# Altium project LPCB225__RLOOP__BMS.PrjPCB
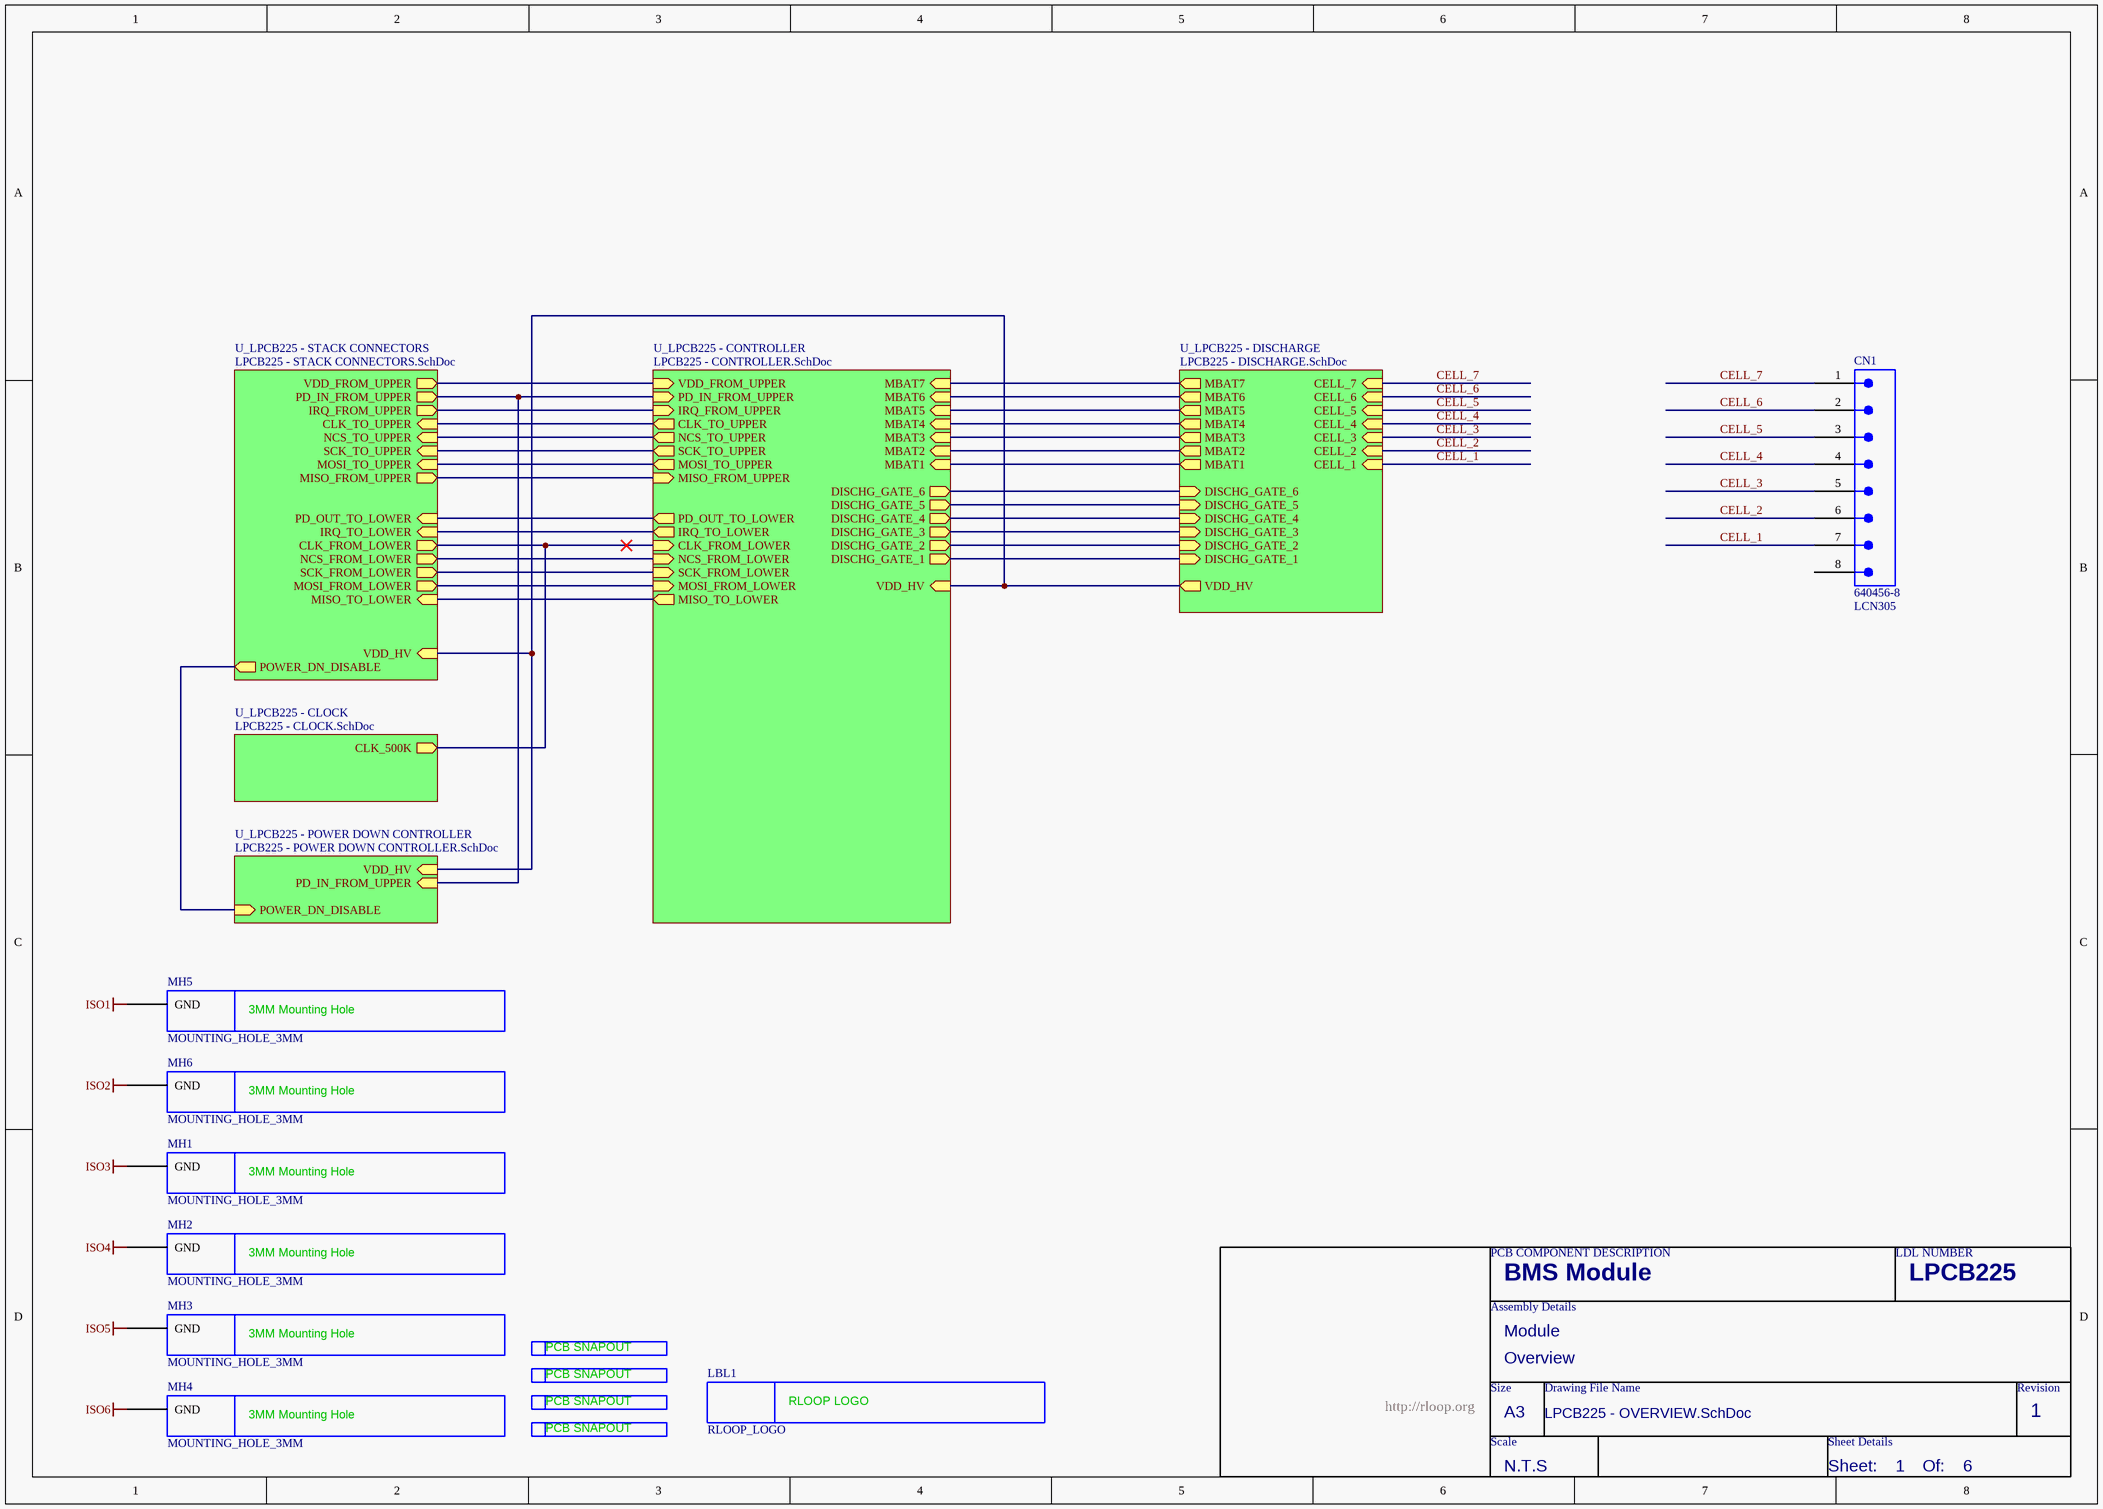
[diagram p0: LPCB225 - OVERVIEW.SchDoc]
6 sheets, 102 parts. Net scope: hierarchical (ports join the sheet entries above them; power ports are global).
Board files: LPCB225R0.PcbDoc, LPCB225R0__ASCII.PcbDoc
Sheets:
  LPCB225 - OVERVIEW.SchDoc
    U_LPCB225 - CONTROLLER = LPCB225 - CONTROLLER.SchDoc
    U_LPCB225 - DISCHARGE = LPCB225 - DISCHARGE.SchDoc
    U_LPCB225 - STACK CONNECTORS = LPCB225 - STACK CONNECTORS.SchDoc
    U_LPCB225 - CLOCK = LPCB225 - CLOCK.SchDoc
    U_LPCB225 - POWER DOWN CONTROLLER = LPCB225 - POWER DOWN CONTROLLER.SchDoc

## Sheet LPCB225 - OVERVIEW.SchDoc
size A3; Address1: Factory 10; Address2: 9-13 Dingley Avenue, Dandeong, VICTORIA 3175, AUSTRALIA; DocumentNumber: 1; Revision: 1; SheetNumber: 1; SheetTotal: 6; Lockie__PCB_SUB_ASSEMBLY: Overview; Lockie__PCB_ASSEMBLY: Module; Lockie__LDL: LPCB225; Lockie__PCB_DESCRIPTION: BMS Module

### Parts
CN1  640456-8  LDL_NUMBER: LCN305  [640456-8]
LBL1  RLOOP_LOGO  [RLOOP_LOGO]  (no BOM)
MH1  MOUNTING_HOLE_3MM  [MOUNTING_HOLE_3MM]  (no BOM)
MH2  MOUNTING_HOLE_3MM  [MOUNTING_HOLE_3MM]  (no BOM)
MH3  MOUNTING_HOLE_3MM  [MOUNTING_HOLE_3MM]  (no BOM)
MH4  MOUNTING_HOLE_3MM  [MOUNTING_HOLE_3MM]  (no BOM)
MH5  MOUNTING_HOLE_3MM  [MOUNTING_HOLE_3MM]  (no BOM)
MH6  MOUNTING_HOLE_3MM  [MOUNTING_HOLE_3MM]  (no BOM)
SN1  PCB_SNAPOUT  [SNAPOUT_NEW]  (value not drawn)  (no BOM)
SN2  PCB_SNAPOUT  [SNAPOUT_NEW]  (value not drawn)  (no BOM)
SN3  PCB_SNAPOUT  [SNAPOUT_NEW]  (value not drawn)  (no BOM)
SN4  PCB_SNAPOUT  [SNAPOUT_NEW]  (value not drawn)  (no BOM)

### Sub-sheets
U_LPCB225 - CLOCK = LPCB225 - CLOCK.SchDoc: CLK_500K (out)
U_LPCB225 - CONTROLLER = LPCB225 - CONTROLLER.SchDoc: PD_IN_FROM_UPPER (in), PD_OUT_TO_LOWER (out), IRQ_FROM_UPPER (in), CLK_TO_UPPER (out), NCS_TO_UPPER (out), SCK_TO_UPPER (out), MOSI_TO_UPPER (out), MISO_FROM_UPPER (in), IRQ_TO_LOWER (out), CLK_FROM_LOWER (in), NCS_FROM_LOWER (in), SCK_FROM_LOWER (in), MOSI_FROM_LOWER (in), MISO_TO_LOWER (out), VDD_FROM_UPPER (in), VDD_HV (in), MBAT7 (in), MBAT1 (in), MBAT2 (in), MBAT3 (in), MBAT4 (in), MBAT5 (in), MBAT6 (in), DISCHG_GATE_1 (out), DISCHG_GATE_2 (out), DISCHG_GATE_3 (out), DISCHG_GATE_4 (out), DISCHG_GATE_5 (out), DISCHG_GATE_6 (out)
U_LPCB225 - DISCHARGE = LPCB225 - DISCHARGE.SchDoc: CELL_7 (in), MBAT7 (out), DISCHG_GATE_6 (in), MBAT6 (out), DISCHG_GATE_5 (in), CELL_6 (in), MBAT5 (out), DISCHG_GATE_4 (in), CELL_5 (in), MBAT4 (out), DISCHG_GATE_3 (in), CELL_4 (in), MBAT3 (out), DISCHG_GATE_2 (in), CELL_3 (in), MBAT2 (out), DISCHG_GATE_1 (in), CELL_2 (in), CELL_1 (in), MBAT1 (out), VDD_HV (out)
U_LPCB225 - POWER DOWN CONTROLLER = LPCB225 - POWER DOWN CONTROLLER.SchDoc: PD_IN_FROM_UPPER (in), VDD_HV (in), POWER_DN_DISABLE (in)
U_LPCB225 - STACK CONNECTORS = LPCB225 - STACK CONNECTORS.SchDoc: PD_IN_FROM_UPPER (out), IRQ_FROM_UPPER (out), CLK_TO_UPPER (in), NCS_TO_UPPER (in), SCK_TO_UPPER (in), MOSI_TO_UPPER (in), MISO_FROM_UPPER (out), VDD_FROM_UPPER (out), PD_OUT_TO_LOWER (in), IRQ_TO_LOWER (in), CLK_FROM_LOWER (out), NCS_FROM_LOWER (out), SCK_FROM_LOWER (out), MOSI_FROM_LOWER (out), MISO_TO_LOWER (in), VDD_HV (in), POWER_DN_DISABLE (out)

### Nets
ISO1: MH5.MOUNT(GND)
ISO2: MH6.MOUNT(GND)
ISO3: MH1.MOUNT(GND)
ISO4: MH2.MOUNT(GND)
ISO5: MH3.MOUNT(GND)
ISO6: MH4.MOUNT(GND)
CELL_1: CN1.7 ; sheet U_LPCB225 - DISCHARGE/CELL_1
CELL_2: CN1.6 ; sheet U_LPCB225 - DISCHARGE/CELL_2
CELL_3: CN1.5 ; sheet U_LPCB225 - DISCHARGE/CELL_3
CELL_4: CN1.4 ; sheet U_LPCB225 - DISCHARGE/CELL_4
CELL_5: CN1.3 ; sheet U_LPCB225 - DISCHARGE/CELL_5
CELL_6: CN1.2 ; sheet U_LPCB225 - DISCHARGE/CELL_6
CELL_7: CN1.1 ; sheet U_LPCB225 - DISCHARGE/CELL_7
CLK_FROM_LOWER: sheet U_LPCB225 - CONTROLLER/CLK_FROM_LOWER, sheet U_LPCB225 - STACK CONNECTORS/CLK_FROM_LOWER, sheet U_LPCB225 - CLOCK/CLK_500K
CLK_TO_UPPER: sheet U_LPCB225 - CONTROLLER/CLK_TO_UPPER, sheet U_LPCB225 - STACK CONNECTORS/CLK_TO_UPPER
IRQ_FROM_UPPER: sheet U_LPCB225 - CONTROLLER/IRQ_FROM_UPPER, sheet U_LPCB225 - STACK CONNECTORS/IRQ_FROM_UPPER
IRQ_TO_LOWER: sheet U_LPCB225 - CONTROLLER/IRQ_TO_LOWER, sheet U_LPCB225 - STACK CONNECTORS/IRQ_TO_LOWER
MBAT1: sheet U_LPCB225 - CONTROLLER/MBAT1, sheet U_LPCB225 - DISCHARGE/MBAT1
MBAT2: sheet U_LPCB225 - CONTROLLER/MBAT2, sheet U_LPCB225 - DISCHARGE/MBAT2
MBAT3: sheet U_LPCB225 - CONTROLLER/MBAT3, sheet U_LPCB225 - DISCHARGE/MBAT3
MBAT4: sheet U_LPCB225 - CONTROLLER/MBAT4, sheet U_LPCB225 - DISCHARGE/MBAT4
MBAT5: sheet U_LPCB225 - CONTROLLER/MBAT5, sheet U_LPCB225 - DISCHARGE/MBAT5
MBAT6: sheet U_LPCB225 - CONTROLLER/MBAT6, sheet U_LPCB225 - DISCHARGE/MBAT6
MBAT7: sheet U_LPCB225 - CONTROLLER/MBAT7, sheet U_LPCB225 - DISCHARGE/MBAT7
MISO_FROM_UPPER: sheet U_LPCB225 - CONTROLLER/MISO_FROM_UPPER, sheet U_LPCB225 - STACK CONNECTORS/MISO_FROM_UPPER
MISO_TO_LOWER: sheet U_LPCB225 - CONTROLLER/MISO_TO_LOWER, sheet U_LPCB225 - STACK CONNECTORS/MISO_TO_LOWER
MOSI_FROM_LOWER: sheet U_LPCB225 - CONTROLLER/MOSI_FROM_LOWER, sheet U_LPCB225 - STACK CONNECTORS/MOSI_FROM_LOWER
MOSI_TO_UPPER: sheet U_LPCB225 - CONTROLLER/MOSI_TO_UPPER, sheet U_LPCB225 - STACK CONNECTORS/MOSI_TO_UPPER
NCS_FROM_LOWER: sheet U_LPCB225 - CONTROLLER/NCS_FROM_LOWER, sheet U_LPCB225 - STACK CONNECTORS/NCS_FROM_LOWER
NCS_TO_UPPER: sheet U_LPCB225 - CONTROLLER/NCS_TO_UPPER, sheet U_LPCB225 - STACK CONNECTORS/NCS_TO_UPPER
PD_IN_FROM_UPPER: sheet U_LPCB225 - CONTROLLER/PD_IN_FROM_UPPER, sheet U_LPCB225 - STACK CONNECTORS/PD_IN_FROM_UPPER, sheet U_LPCB225 - POWER DOWN CONTROLLER/PD_IN_FROM_UPPER
PD_OUT_TO_LOWER: sheet U_LPCB225 - CONTROLLER/PD_OUT_TO_LOWER, sheet U_LPCB225 - STACK CONNECTORS/PD_OUT_TO_LOWER
SCK_FROM_LOWER: sheet U_LPCB225 - CONTROLLER/SCK_FROM_LOWER, sheet U_LPCB225 - STACK CONNECTORS/SCK_FROM_LOWER
SCK_TO_UPPER: sheet U_LPCB225 - CONTROLLER/SCK_TO_UPPER, sheet U_LPCB225 - STACK CONNECTORS/SCK_TO_UPPER
VDD_FROM_UPPER: sheet U_LPCB225 - CONTROLLER/VDD_FROM_UPPER, sheet U_LPCB225 - STACK CONNECTORS/VDD_FROM_UPPER
VDD_HV: sheet U_LPCB225 - CONTROLLER/VDD_HV, sheet U_LPCB225 - DISCHARGE/VDD_HV, sheet U_LPCB225 - STACK CONNECTORS/VDD_HV, sheet U_LPCB225 - POWER DOWN CONTROLLER/VDD_HV
NetCN2_13: sheet U_LPCB225 - STACK CONNECTORS/POWER_DN_DISABLE, sheet U_LPCB225 - POWER DOWN CONTROLLER/POWER_DN_DISABLE
NetIC3_1: sheet U_LPCB225 - CONTROLLER/DISCHG_GATE_5, sheet U_LPCB225 - DISCHARGE/DISCHG_GATE_5
NetIC3_3: sheet U_LPCB225 - CONTROLLER/DISCHG_GATE_4, sheet U_LPCB225 - DISCHARGE/DISCHG_GATE_4
NetIC3_5: sheet U_LPCB225 - CONTROLLER/DISCHG_GATE_3, sheet U_LPCB225 - DISCHARGE/DISCHG_GATE_3
NetIC3_7: sheet U_LPCB225 - CONTROLLER/DISCHG_GATE_2, sheet U_LPCB225 - DISCHARGE/DISCHG_GATE_2
NetIC3_9: sheet U_LPCB225 - CONTROLLER/DISCHG_GATE_1, sheet U_LPCB225 - DISCHARGE/DISCHG_GATE_1
NetIC3_47: sheet U_LPCB225 - CONTROLLER/DISCHG_GATE_6, sheet U_LPCB225 - DISCHARGE/DISCHG_GATE_6

Not connected (* = marked no-connect by the designer): CN1 8

### Notes on the sheet
- PCB COMPONENT DESCRIPTION
- LDL NUMBER
- Assembly Details
- Size
- Drawing File Name
- Revision
- http://rloop.org
- Scale
- A3
- Sheet Details
- N.T.S
- Sheet:
- Of:
- (in symbol MOUNTING_HOLE_3MM) 3MM Mounting Hole
- (in symbol PCB_SNAPOUT) PCB SNAPOUT
- (in symbol RLOOP_LOGO) RLOOP LOGO

### Library data of the parts
CN1 = 640456-8: Connector, Male Header, 8 Way; FMEDA__CHANNEL: COM; FMEDA__OPERATING__CURRENT_MAX: 0; FMEDA__OPERATING__TEMP_MAX: 50; FMEDA__OPERATING__TEMP_MIN: -20; FMEDA__OPERATING__TEMP_TYP: 27; FMEDA__OPERATING__VOLTAGE_MAX: 16; FMEDA__OPERATING__VOLTAGE_TYP: 12; FMEDA__FUNCTION_IN_SYSTEM: *; FMEDA__OPERATING__CURRENT_MIN: 0; FMEDA__OPERATING__CURRENT_TYP: 0; FMEDA__OPERATING__VOLTAGE_MIN: 0
LBL1 = RLOOP_LOGO: FMEDA__CHANNEL: DIAG; FMEDA__FUNCTION_IN_SYSTEM: *
MH1-MH6 = MOUNTING_HOLE_3MM: 3MM Mouting Hole; FMEDA__CHANNEL: DIAG; FMEDA__FUNCTION_IN_SYSTEM: *
SN1-SN4 = PCB_SNAPOUT: FMEDA__CHANNEL: DIAG; FMEDA__FUNCTION_IN_SYSTEM: *

## Sheet LPCB225 - CONTROLLER.SchDoc
size A3; Address1: Factory 10; Address2: 9-13 Dingley Avenue, Dandeong, VICTORIA 3175, AUSTRALIA; DocumentNumber: 3; Revision: 1; SheetNumber: 3; SheetTotal: 6; Lockie__PCB_SUB_ASSEMBLY: Main Controller; Lockie__PCB_ASSEMBLY: Module; Lockie__LDL: LPCB225; Lockie__PCB_DESCRIPTION: BMS Module
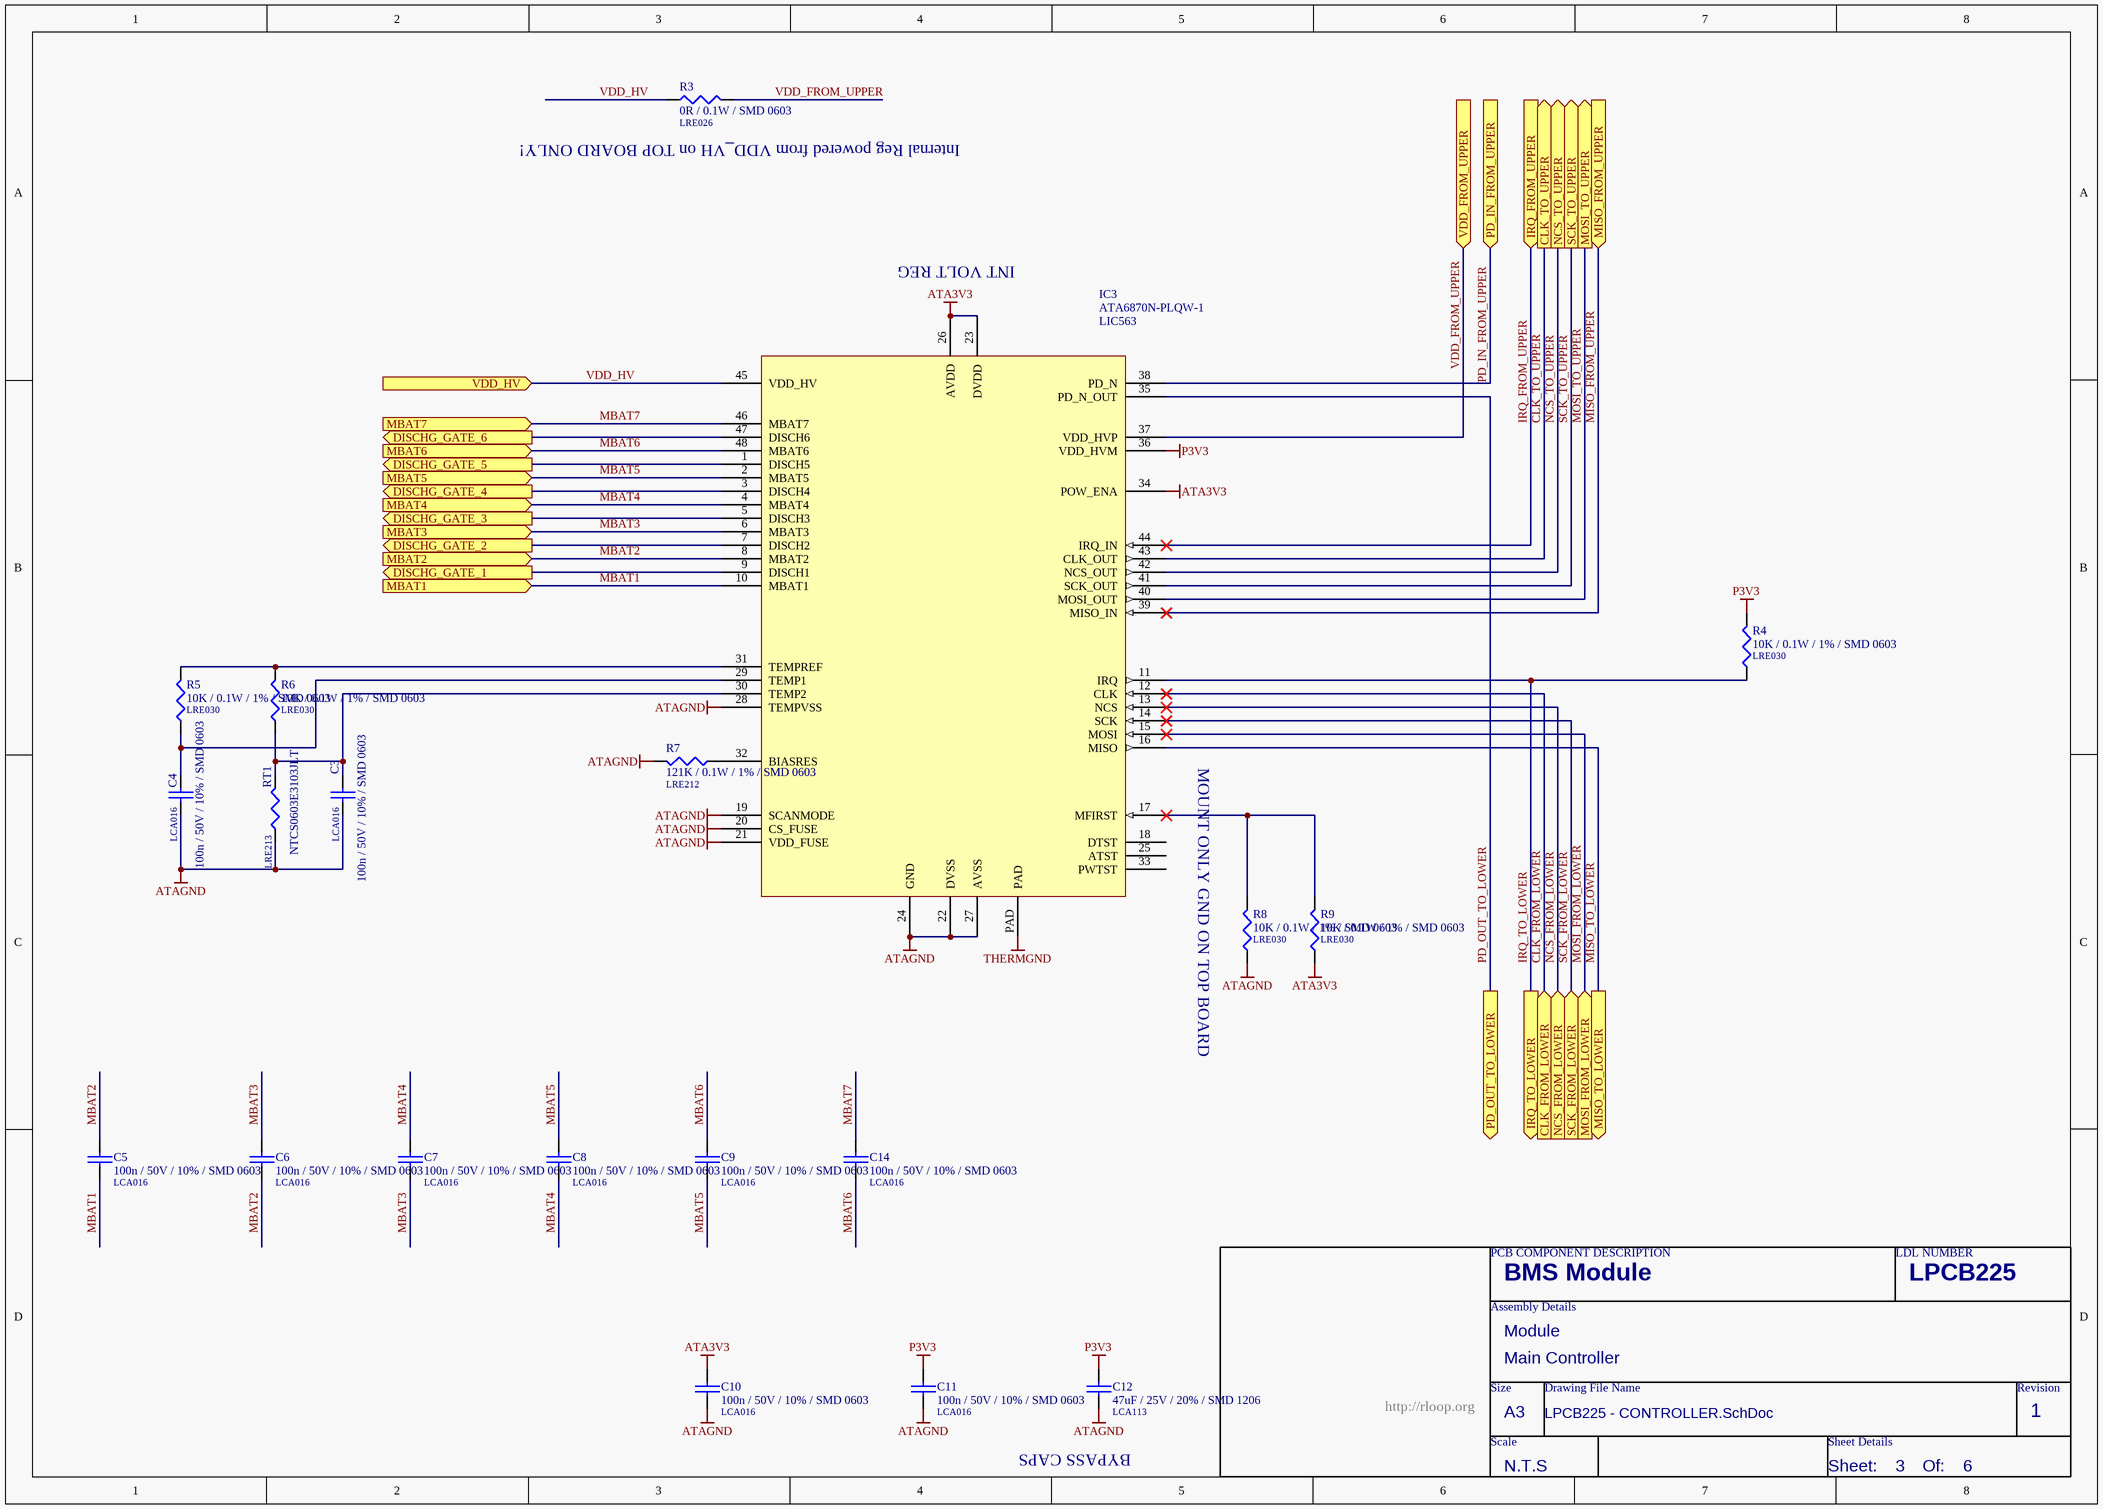
[diagram p1: LPCB225 - CONTROLLER.SchDoc]

### Parts
C3  100n / 50V / 10% / SMD 0603  LDL_NUMBER: LCA016  [LFP011__CC1608-0603-IPC7351_B]
C4  100n / 50V / 10% / SMD 0603  LDL_NUMBER: LCA016  [LFP011__CC1608-0603-IPC7351_B]
C5  100n / 50V / 10% / SMD 0603  LDL_NUMBER: LCA016  [LFP011__CC1608-0603-IPC7351_B]
C6  100n / 50V / 10% / SMD 0603  LDL_NUMBER: LCA016  [LFP011__CC1608-0603-IPC7351_B]
C7  100n / 50V / 10% / SMD 0603  LDL_NUMBER: LCA016  [LFP011__CC1608-0603-IPC7351_B]
C8  100n / 50V / 10% / SMD 0603  LDL_NUMBER: LCA016  [LFP011__CC1608-0603-IPC7351_B]
C9  100n / 50V / 10% / SMD 0603  LDL_NUMBER: LCA016  [LFP011__CC1608-0603-IPC7351_B]
C10  100n / 50V / 10% / SMD 0603  LDL_NUMBER: LCA016  [LFP011__CC1608-0603-IPC7351_B]
C11  100n / 50V / 10% / SMD 0603  LDL_NUMBER: LCA016  [LFP011__CC1608-0603-IPC7351_B]
C12  47uF / 25V / 20% / SMD 1206  LDL_NUMBER: LCA113  [LFP043__CC3216-1206]
C14  100n / 50V / 10% / SMD 0603  LDL_NUMBER: LCA016  [LFP011__CC1608-0603-IPC7351_B]
IC3  ATA6870N-PLQW-1  LDL_NUMBER: LIC563  [LFP136__QFN50P700X700X80_HS-49M]
R3  0R / 0.1W / SMD 0603  LDL_NUMBER: LRE026  [LFP020__CR1608-0603-IPC7351_B]
R4  10K / 0.1W / 1% / SMD 0603  LDL_NUMBER: LRE030  [LFP020__CR1608-0603-IPC7351_B]
R5  10K / 0.1W / 1% / SMD 0603  LDL_NUMBER: LRE030  [LFP020__CR1608-0603-IPC7351_B]
R6  10K / 0.1W / 1% / SMD 0603  LDL_NUMBER: LRE030  [LFP020__CR1608-0603-IPC7351_B]
R7  121K / 0.1W / 1% / SMD 0603  LDL_NUMBER: LRE212  [LFP020__CR1608-0603-IPC7351_B]
R8  10K / 0.1W / 1% / SMD 0603  LDL_NUMBER: LRE030  [LFP020__CR1608-0603-IPC7351_B]
R9  10K / 0.1W / 1% / SMD 0603  LDL_NUMBER: LRE030  [LFP020__CR1608-0603-IPC7351_B]
RT1  NTCS0603E3103JLT  LDL_NUMBER: LRE213  [LFP020__CR1608-0603-IPC7351_B]

### Ports
CLK_FROM_LOWER (in), CLK_TO_UPPER (out), DISCHG_GATE_1 (out), DISCHG_GATE_2 (out), DISCHG_GATE_3 (out), DISCHG_GATE_4 (out), DISCHG_GATE_5 (out), DISCHG_GATE_6 (out), IRQ_FROM_UPPER (in), IRQ_TO_LOWER (out), MBAT1 (in), MBAT2 (in), MBAT3 (in), MBAT4 (in), MBAT5 (in), MBAT6 (in), MBAT7 (in), MISO_FROM_UPPER (in), MISO_TO_LOWER (out), MOSI_FROM_LOWER (in), MOSI_TO_UPPER (out), NCS_FROM_LOWER (in), NCS_TO_UPPER (out), PD_IN_FROM_UPPER (in), PD_OUT_TO_LOWER (out), SCK_FROM_LOWER (in), SCK_TO_UPPER (out), VDD_FROM_UPPER (in), VDD_HV (in)

### Nets
ATA3V3: C10.1 IC3.23(DVDD) IC3.26(AVDD) IC3.34(POW_ENA) R9.1
ATAGND: C3.2 C4.2 C10.2 C11.2 C12.2 IC3.19(SCANMODE) IC3.20(CS_FUSE) IC3.21(VDD_FUSE) IC3.22(DVSS) IC3.24(GND) IC3.27(AVSS) IC3.28(TEMPVSS) R7.2 R8.1 RT1.1
P3V3: C11.1 C12.1 IC3.36(VDD_HVM) R4.2
THERMGND: IC3.PAD
CLK_FROM_LOWER: IC3.12(CLK) ; port CLK_FROM_LOWER
CLK_TO_UPPER: IC3.43(CLK_OUT) ; port CLK_TO_UPPER
IRQ_FROM_UPPER: IC3.44(IRQ_IN) ; port IRQ_FROM_UPPER
IRQ_TO_LOWER: IC3.11(IRQ) R4.1 ; port IRQ_TO_LOWER
MBAT1: C5.2 IC3.10(MBAT1) ; port MBAT1
MBAT2: C5.1 C6.2 IC3.8(MBAT2) ; port MBAT2
MBAT3: C6.1 C7.2 IC3.6(MBAT3) ; port MBAT3
MBAT4: C7.1 C8.2 IC3.4(MBAT4) ; port MBAT4
MBAT5: C8.1 C9.2 IC3.2(MBAT5) ; port MBAT5
MBAT6: C9.1 C14.2 IC3.48(MBAT6) ; port MBAT6
MBAT7: C14.1 IC3.46(MBAT7) ; port MBAT7
MISO_FROM_UPPER: IC3.39(MISO_IN) ; port MISO_FROM_UPPER
MISO_TO_LOWER: IC3.16(MISO) ; port MISO_TO_LOWER
MOSI_FROM_LOWER: IC3.15(MOSI) ; port MOSI_FROM_LOWER
MOSI_TO_UPPER: IC3.40(MOSI_OUT) ; port MOSI_TO_UPPER
NCS_FROM_LOWER: IC3.13(NCS) ; port NCS_FROM_LOWER
NCS_TO_UPPER: IC3.42(NCS_OUT) ; port NCS_TO_UPPER
PD_IN_FROM_UPPER: IC3.38(PD_N) ; port PD_IN_FROM_UPPER
PD_OUT_TO_LOWER: IC3.35(PD_N_OUT) ; port PD_OUT_TO_LOWER
SCK_FROM_LOWER: IC3.14(SCK) ; port SCK_FROM_LOWER
SCK_TO_UPPER: IC3.41(SCK_OUT) ; port SCK_TO_UPPER
VDD_FROM_UPPER: IC3.37(VDD_HVP) R3.2 ; port VDD_FROM_UPPER
VDD_HV: IC3.45(VDD_HV) R3.1 ; port VDD_HV
NetC3_1: C3.1 IC3.30(TEMP2) R6.1 RT1.2
NetC4_1: C4.1 IC3.29(TEMP1) R5.1
NetIC3_1: IC3.1(DISCH5) ; port DISCHG_GATE_5
NetIC3_3: IC3.3(DISCH4) ; port DISCHG_GATE_4
NetIC3_5: IC3.5(DISCH3) ; port DISCHG_GATE_3
NetIC3_7: IC3.7(DISCH2) ; port DISCHG_GATE_2
NetIC3_9: IC3.9(DISCH1) ; port DISCHG_GATE_1
NetIC3_17: IC3.17(MFIRST) R8.2 R9.2
NetIC3_31: IC3.31(TEMPREF) R5.2 R6.2
NetIC3_32: IC3.32(BIASRES) R7.1
NetIC3_47: IC3.47(DISCH6) ; port DISCHG_GATE_6

Not connected (* = marked no-connect by the designer): IC3 18(DTST) 25(ATST) 33(PWTST)

### Notes on the sheet
- (near R3) Internal Reg powered from VDD_VH on TOP BOARD ONLY!
- INT VOLT REG
- (near R8) MOUNT ONLY GND ON TOP BOARD
- BYPASS CAPS
- PCB COMPONENT DESCRIPTION
- LDL NUMBER
- Assembly Details
- Size
- Drawing File Name
- Revision
- http://rloop.org
- Scale
- A3
- Sheet Details
- N.T.S
- Sheet:
- Of:

### Library data of the parts
C3-C11 C14 = 100n / 50V / 10% / SMD 0603: Capacitor, Ceramic Chip, 100nF (0.1uF), 50V, 5%, SMD 0603 [LCA016]; FMEDA__OPERATING__VOLTAGE_MIN: 0; FMEDA__OPERATING__VOLTAGE_MAX: 3.3; FMEDA__OPERATING__TEMP_MIN: -20; FMEDA__OPERATING__TEMP_TYP: 27; FMEDA__OPERATING__TEMP_MAX: 50; FMEDA__CHANNEL: COM; Value: 100n; FMEDA__FUNCTION_IN_SYSTEM: *; FMEDA__OPERATING__VOLTAGE_TYP: 3.3
C12 = 47uF / 25V / 20% / SMD 1206: Capacitor, Ceramic Chip, 47uF, 25V, 20%, SMD 1206 [LCA113]; Value: 47u; FMEDA__OPERATING__TEMP_MAX: 50; FMEDA__OPERATING__TEMP_MIN: -20; FMEDA__OPERATING__TEMP_TYP: 27; FMEDA__OPERATING__VOLTAGE_MAX: 3.3; FMEDA__OPERATING__VOLTAGE_MIN: 0; FMEDA__CHANNEL: COM; FMEDA__FUNCTION_IN_SYSTEM: *; FMEDA__OPERATING__VOLTAGE_TYP: 3.3
R3 = 0R / 0.1W / SMD 0603: Resistor, Ceramic Chip, 0R, 0.1W, SMD 0603 [LRE026]; Value: 0; FMEDA__OPERATING__TEMP_MAX: 50; FMEDA__OPERATING__TEMP_MIN: -20; FMEDA__OPERATING__TEMP_TYP: 27; FMEDA__CHANNEL: COM; FMEDA__OPERATING__POWER_MAX: 0; FMEDA__OPERATING__POWER_MIN: 0; FMEDA__OPERATING__VOLTAGE_MAX: 0; FMEDA__OPERATING__VOLTAGE_MIN: 0; FMEDA__OPERATING__VOLTAGE_TYP: 0; FMEDA__FUNCTION_IN_SYSTEM: *
R4-R6 R8 R9 = 10K / 0.1W / 1% / SMD 0603: Resistor, Ceramic Chip, 10K, 0.1W, 1%, SMD 0603 [LRE030]; FMEDA__OPERATING__POWER_MAX: 0; FMEDA__OPERATING__TEMP_MAX: 50; FMEDA__OPERATING__TEMP_MIN: -20; FMEDA__OPERATING__TEMP_TYP: 27; FMEDA__CHANNEL: COM; Value: 10K; FMEDA__OPERATING__POWER_MIN: 0; FMEDA__OPERATING__VOLTAGE_MAX: 0; FMEDA__OPERATING__VOLTAGE_MIN: 0; FMEDA__OPERATING__VOLTAGE_TYP: 0; FMEDA__FUNCTION_IN_SYSTEM: *
R7 = 121K / 0.1W / 1% / SMD 0603: Resistor, Ceramic Chip, 121K, 0.1W, SMD 0603 [LRE212]; FMEDA__OPERATING__POWER_MAX: 0; FMEDA__OPERATING__TEMP_MAX: 50; FMEDA__OPERATING__TEMP_MIN: -20; FMEDA__OPERATING__TEMP_TYP: 27; FMEDA__CHANNEL: COM; Value: 121K; FMEDA__OPERATING__POWER_MIN: 0; FMEDA__OPERATING__VOLTAGE_MAX: 0; FMEDA__OPERATING__VOLTAGE_MIN: 0; FMEDA__OPERATING__VOLTAGE_TYP: 0; FMEDA__FUNCTION_IN_SYSTEM: *
RT1 = NTCS0603E3103JLT: Thermistor, 10K, 5%, SMD 0603 [LRE213]; FMEDA__OPERATING__POWER_MAX: 0.01; FMEDA__OPERATING__POWER_MIN: 0; FMEDA__OPERATING__TEMP_MAX: 50; FMEDA__OPERATING__TEMP_MIN: -20; FMEDA__OPERATING__TEMP_TYP: 27; FMEDA__CHANNEL: COM; Value: 10K; FMEDA__OPERATING__VOLTAGE_MAX: 0; FMEDA__OPERATING__VOLTAGE_MIN: 0; FMEDA__OPERATING__VOLTAGE_TYP: 0; FMEDA__FUNCTION_IN_SYSTEM: *

## Sheet LPCB225 - DISCHARGE.SchDoc
size A3; Address1: Factory 10; Address2: 9-13 Dingley Avenue, Dandeong, VICTORIA 3175, AUSTRALIA; DocumentNumber: 4; Revision: 1; SheetNumber: 4; SheetTotal: 6; Lockie__PCB_SUB_ASSEMBLY: Discharge Section; Lockie__PCB_ASSEMBLY: Module; Lockie__LDL: LPCB225; Lockie__PCB_DESCRIPTION: BMS Module
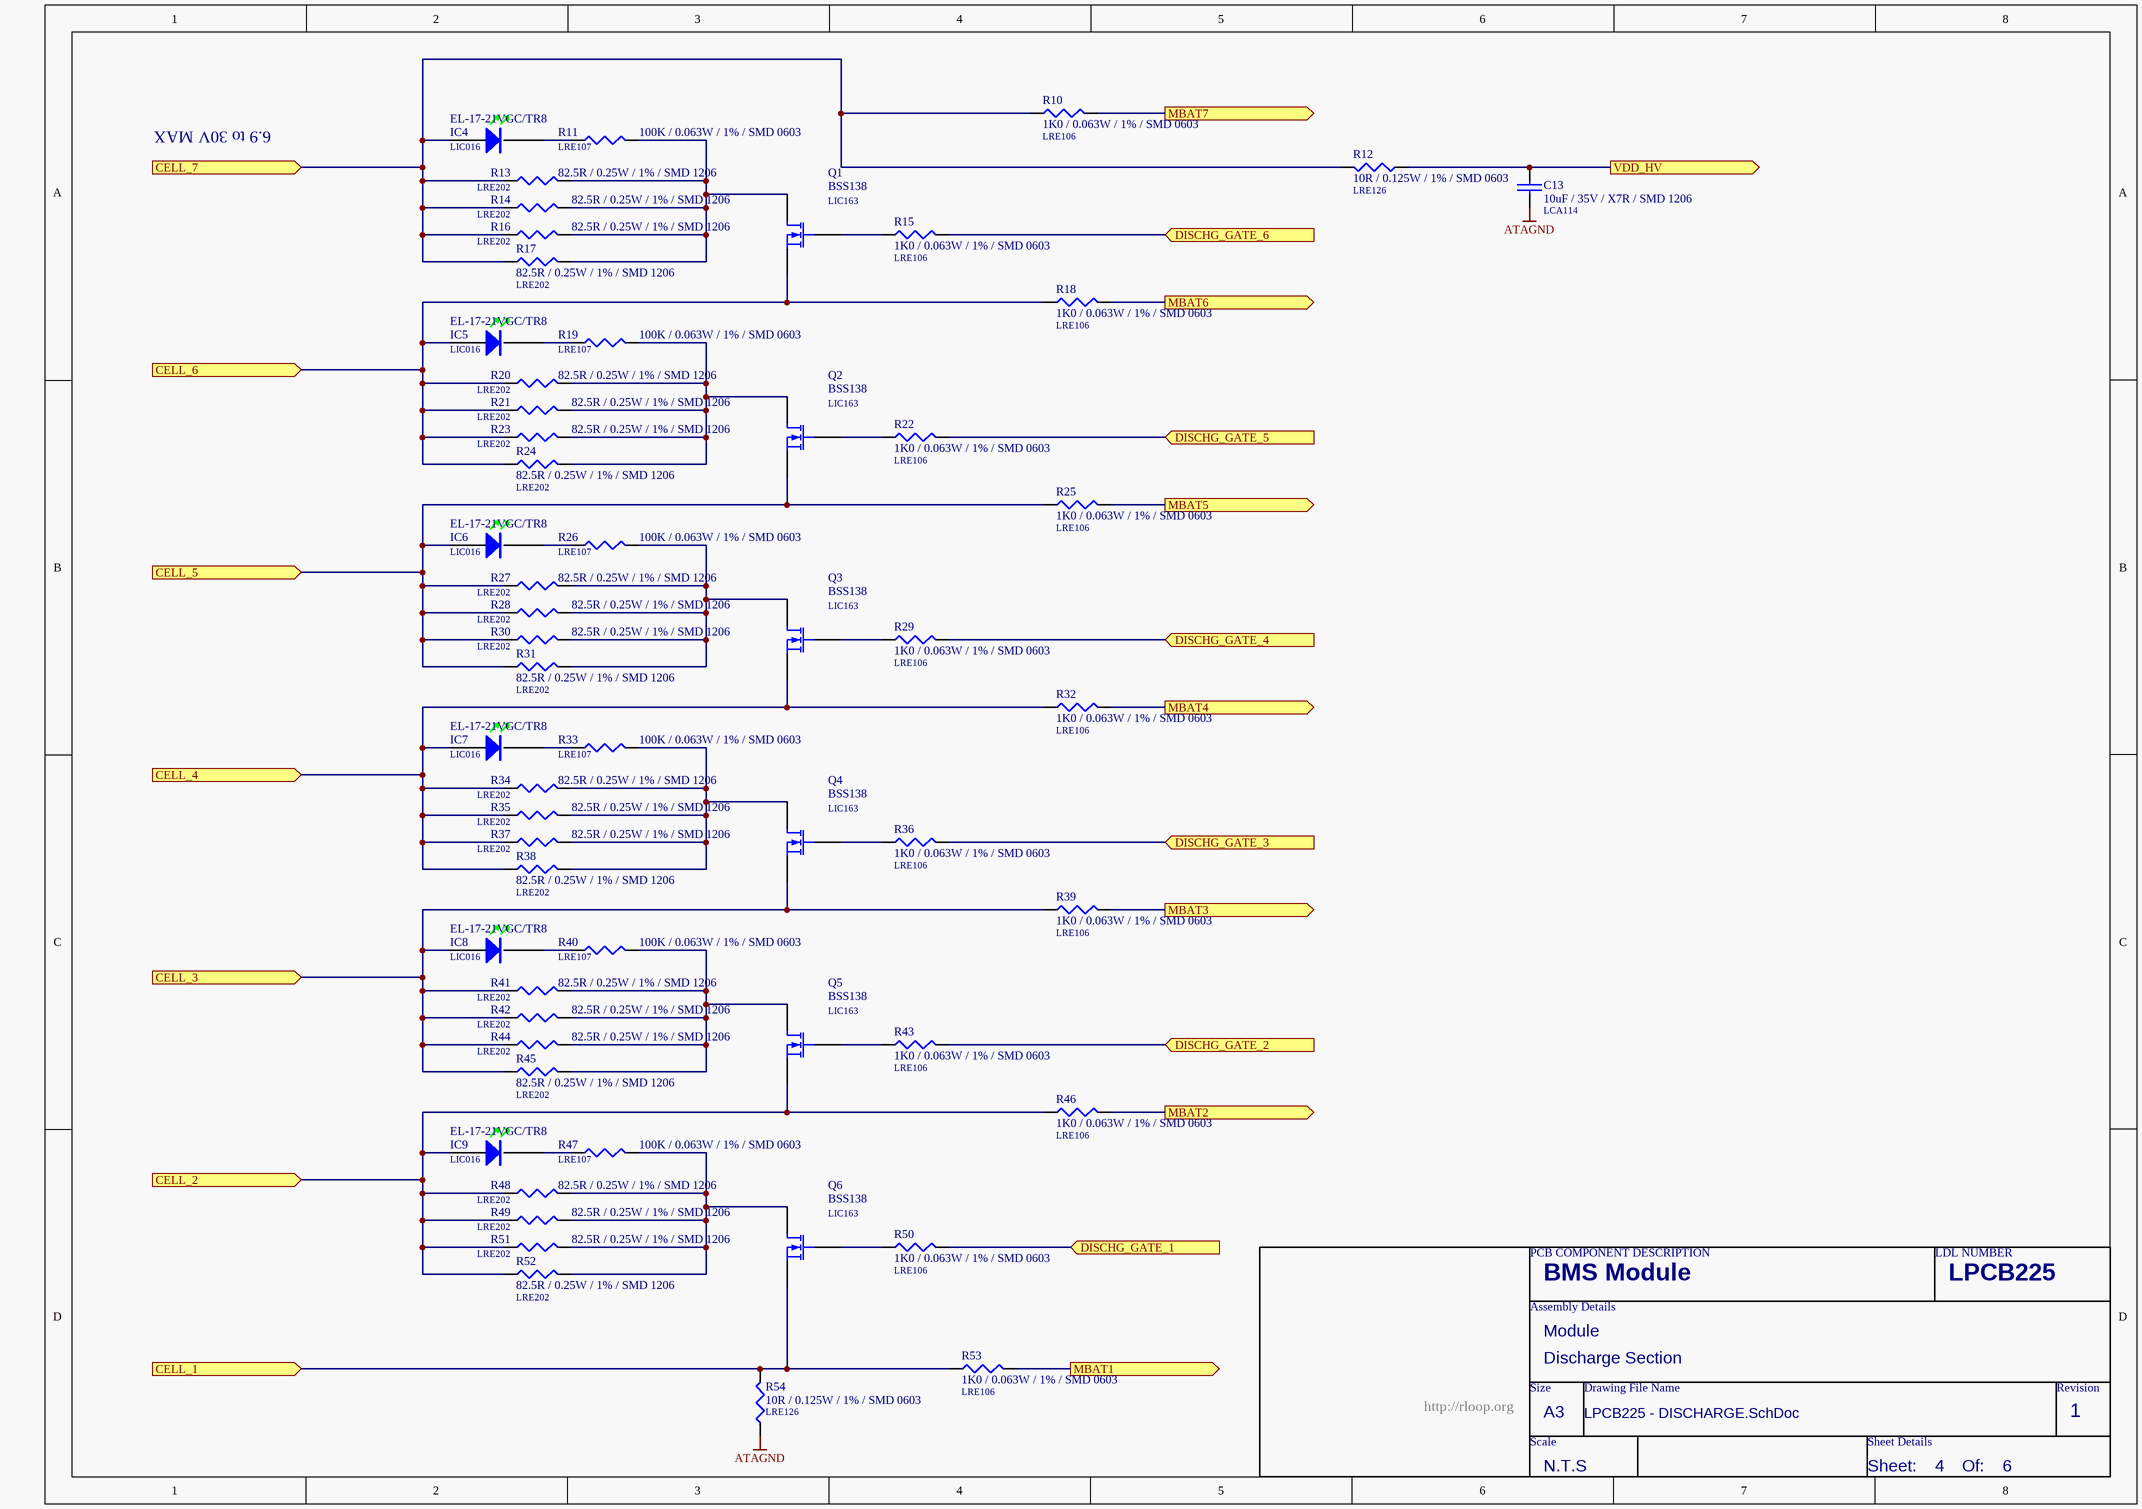
[diagram p2: LPCB225 - DISCHARGE.SchDoc]

### Parts
C13  10uF / 35V / X7R / SMD 1206  LDL_NUMBER: LCA114  [LFP043__CC3216-1206]
IC4  EL-17-21VGC/TR8  LDL_NUMBER: LIC016  [CR2012-0805-LED]
IC5  EL-17-21VGC/TR8  LDL_NUMBER: LIC016  [CR2012-0805-LED]
IC6  EL-17-21VGC/TR8  LDL_NUMBER: LIC016  [CR2012-0805-LED]
IC7  EL-17-21VGC/TR8  LDL_NUMBER: LIC016  [CR2012-0805-LED]
IC8  EL-17-21VGC/TR8  LDL_NUMBER: LIC016  [CR2012-0805-LED]
IC9  EL-17-21VGC/TR8  LDL_NUMBER: LIC016  [CR2012-0805-LED]
Q1  BSS138  LDL_NUMBER: LIC163  [LFP021__SOT23]
Q2  BSS138  LDL_NUMBER: LIC163  [LFP021__SOT23]
Q3  BSS138  LDL_NUMBER: LIC163  [LFP021__SOT23]
Q4  BSS138  LDL_NUMBER: LIC163  [LFP021__SOT23]
Q5  BSS138  LDL_NUMBER: LIC163  [LFP021__SOT23]
Q6  BSS138  LDL_NUMBER: LIC163  [LFP021__SOT23]
R10  1K0 / 0.063W / 1% / SMD 0603  LDL_NUMBER: LRE106  [LFP020__CR1608-0603-IPC7351_B]
R11  100K / 0.063W / 1% / SMD 0603  LDL_NUMBER: LRE107  [LFP020__CR1608-0603-IPC7351_B]
R12  10R / 0.125W / 1% / SMD 0603  LDL_NUMBER: LRE126  [LFP020__CR1608-0603-IPC7351_B]
R13  82.5R / 0.25W / 1% / SMD 1206  LDL_NUMBER: LRE202  [LFP107__CR3216-1206]
R14  82.5R / 0.25W / 1% / SMD 1206  LDL_NUMBER: LRE202  [LFP107__CR3216-1206]
R15  1K0 / 0.063W / 1% / SMD 0603  LDL_NUMBER: LRE106  [LFP020__CR1608-0603-IPC7351_B]
R16  82.5R / 0.25W / 1% / SMD 1206  LDL_NUMBER: LRE202  [LFP107__CR3216-1206]
R17  82.5R / 0.25W / 1% / SMD 1206  LDL_NUMBER: LRE202  [LFP107__CR3216-1206]
R18  1K0 / 0.063W / 1% / SMD 0603  LDL_NUMBER: LRE106  [LFP020__CR1608-0603-IPC7351_B]
R19  100K / 0.063W / 1% / SMD 0603  LDL_NUMBER: LRE107  [LFP020__CR1608-0603-IPC7351_B]
R20  82.5R / 0.25W / 1% / SMD 1206  LDL_NUMBER: LRE202  [LFP107__CR3216-1206]
R21  82.5R / 0.25W / 1% / SMD 1206  LDL_NUMBER: LRE202  [LFP107__CR3216-1206]
R22  1K0 / 0.063W / 1% / SMD 0603  LDL_NUMBER: LRE106  [LFP020__CR1608-0603-IPC7351_B]
R23  82.5R / 0.25W / 1% / SMD 1206  LDL_NUMBER: LRE202  [LFP107__CR3216-1206]
R24  82.5R / 0.25W / 1% / SMD 1206  LDL_NUMBER: LRE202  [LFP107__CR3216-1206]
R25  1K0 / 0.063W / 1% / SMD 0603  LDL_NUMBER: LRE106  [LFP020__CR1608-0603-IPC7351_B]
R26  100K / 0.063W / 1% / SMD 0603  LDL_NUMBER: LRE107  [LFP020__CR1608-0603-IPC7351_B]
R27  82.5R / 0.25W / 1% / SMD 1206  LDL_NUMBER: LRE202  [LFP107__CR3216-1206]
R28  82.5R / 0.25W / 1% / SMD 1206  LDL_NUMBER: LRE202  [LFP107__CR3216-1206]
R29  1K0 / 0.063W / 1% / SMD 0603  LDL_NUMBER: LRE106  [LFP020__CR1608-0603-IPC7351_B]
R30  82.5R / 0.25W / 1% / SMD 1206  LDL_NUMBER: LRE202  [LFP107__CR3216-1206]
R31  82.5R / 0.25W / 1% / SMD 1206  LDL_NUMBER: LRE202  [LFP107__CR3216-1206]
R32  1K0 / 0.063W / 1% / SMD 0603  LDL_NUMBER: LRE106  [LFP020__CR1608-0603-IPC7351_B]
R33  100K / 0.063W / 1% / SMD 0603  LDL_NUMBER: LRE107  [LFP020__CR1608-0603-IPC7351_B]
R34  82.5R / 0.25W / 1% / SMD 1206  LDL_NUMBER: LRE202  [LFP107__CR3216-1206]
R35  82.5R / 0.25W / 1% / SMD 1206  LDL_NUMBER: LRE202  [LFP107__CR3216-1206]
R36  1K0 / 0.063W / 1% / SMD 0603  LDL_NUMBER: LRE106  [LFP020__CR1608-0603-IPC7351_B]
R37  82.5R / 0.25W / 1% / SMD 1206  LDL_NUMBER: LRE202  [LFP107__CR3216-1206]
R38  82.5R / 0.25W / 1% / SMD 1206  LDL_NUMBER: LRE202  [LFP107__CR3216-1206]
R39  1K0 / 0.063W / 1% / SMD 0603  LDL_NUMBER: LRE106  [LFP020__CR1608-0603-IPC7351_B]
R40  100K / 0.063W / 1% / SMD 0603  LDL_NUMBER: LRE107  [LFP020__CR1608-0603-IPC7351_B]
R41  82.5R / 0.25W / 1% / SMD 1206  LDL_NUMBER: LRE202  [LFP107__CR3216-1206]
R42  82.5R / 0.25W / 1% / SMD 1206  LDL_NUMBER: LRE202  [LFP107__CR3216-1206]
R43  1K0 / 0.063W / 1% / SMD 0603  LDL_NUMBER: LRE106  [LFP020__CR1608-0603-IPC7351_B]
R44  82.5R / 0.25W / 1% / SMD 1206  LDL_NUMBER: LRE202  [LFP107__CR3216-1206]
R45  82.5R / 0.25W / 1% / SMD 1206  LDL_NUMBER: LRE202  [LFP107__CR3216-1206]
R46  1K0 / 0.063W / 1% / SMD 0603  LDL_NUMBER: LRE106  [LFP020__CR1608-0603-IPC7351_B]
R47  100K / 0.063W / 1% / SMD 0603  LDL_NUMBER: LRE107  [LFP020__CR1608-0603-IPC7351_B]
R48  82.5R / 0.25W / 1% / SMD 1206  LDL_NUMBER: LRE202  [LFP107__CR3216-1206]
R49  82.5R / 0.25W / 1% / SMD 1206  LDL_NUMBER: LRE202  [LFP107__CR3216-1206]
R50  1K0 / 0.063W / 1% / SMD 0603  LDL_NUMBER: LRE106  [LFP020__CR1608-0603-IPC7351_B]
R51  82.5R / 0.25W / 1% / SMD 1206  LDL_NUMBER: LRE202  [LFP107__CR3216-1206]
R52  82.5R / 0.25W / 1% / SMD 1206  LDL_NUMBER: LRE202  [LFP107__CR3216-1206]
R53  1K0 / 0.063W / 1% / SMD 0603  LDL_NUMBER: LRE106  [LFP020__CR1608-0603-IPC7351_B]
R54  10R / 0.125W / 1% / SMD 0603  LDL_NUMBER: LRE126  [LFP020__CR1608-0603-IPC7351_B]

### Ports
CELL_1 (in), CELL_2 (in), CELL_3 (in), CELL_4 (in), CELL_5 (in), CELL_6 (in), CELL_7 (in), DISCHG_GATE_1 (in), DISCHG_GATE_2 (in), DISCHG_GATE_3 (in), DISCHG_GATE_4 (in), DISCHG_GATE_5 (in), DISCHG_GATE_6 (in), MBAT1 (out), MBAT2 (out), MBAT3 (out), MBAT4 (out), MBAT5 (out), MBAT6 (out), MBAT7 (out), VDD_HV (out)

### Nets
ATAGND: C13.2 R54.1
CELL_1: Q6.2(S) R53.1 R54.2 ; port CELL_1
CELL_2: IC9.A Q5.2(S) R46.1 R48.1 R49.1 R51.1 R52.1 ; port CELL_2
CELL_3: IC8.A Q4.2(S) R39.1 R41.1 R42.1 R44.1 R45.1 ; port CELL_3
CELL_4: IC7.A Q3.2(S) R32.1 R34.1 R35.1 R37.1 R38.1 ; port CELL_4
CELL_5: IC6.A Q2.2(S) R25.1 R27.1 R28.1 R30.1 R31.1 ; port CELL_5
CELL_6: IC5.A Q1.2(S) R18.1 R20.1 R21.1 R23.1 R24.1 ; port CELL_6
CELL_7: IC4.A R10.1 R12.2 R13.1 R14.1 R16.1 R17.1 ; port CELL_7
MBAT1: R53.2 ; port MBAT1
MBAT2: R46.2 ; port MBAT2
MBAT3: R39.2 ; port MBAT3
MBAT4: R32.2 ; port MBAT4
MBAT5: R25.2 ; port MBAT5
MBAT6: R18.2 ; port MBAT6
MBAT7: R10.2 ; port MBAT7
VDD_HV: C13.1 R12.1 ; port VDD_HV
NetIC3_1: R22.2 ; port DISCHG_GATE_5
NetIC3_3: R29.2 ; port DISCHG_GATE_4
NetIC3_5: R36.2 ; port DISCHG_GATE_3
NetIC3_7: R43.2 ; port DISCHG_GATE_2
NetIC3_9: R50.2 ; port DISCHG_GATE_1
NetIC3_47: R15.2 ; port DISCHG_GATE_6
NetIC4_K: IC4.K R11.1
NetIC5_K: IC5.K R19.1
NetIC6_K: IC6.K R26.1
NetIC7_K: IC7.K R33.1
NetIC8_K: IC8.K R40.1
NetIC9_K: IC9.K R47.1
NetQ1_1: Q1.1(G) R15.1
NetQ1_3: Q1.3(D) R11.2 R13.2 R14.2 R16.2 R17.2
NetQ2_1: Q2.1(G) R22.1
NetQ2_3: Q2.3(D) R19.2 R20.2 R21.2 R23.2 R24.2
NetQ3_1: Q3.1(G) R29.1
NetQ3_3: Q3.3(D) R26.2 R27.2 R28.2 R30.2 R31.2
NetQ4_1: Q4.1(G) R36.1
NetQ4_3: Q4.3(D) R33.2 R34.2 R35.2 R37.2 R38.2
NetQ5_1: Q5.1(G) R43.1
NetQ5_3: Q5.3(D) R40.2 R41.2 R42.2 R44.2 R45.2
NetQ6_1: Q6.1(G) R50.1
NetQ6_3: Q6.3(D) R47.2 R48.2 R49.2 R51.2 R52.2

### Notes on the sheet
- 6.9 to 30V MAX
- PCB COMPONENT DESCRIPTION
- LDL NUMBER
- Assembly Details
- Size
- Drawing File Name
- Revision
- http://rloop.org
- Scale
- A3
- Sheet Details
- N.T.S
- Sheet:
- Of:

### Library data of the parts
C13 = 10uF / 35V / X7R / SMD 1206: Capactor, Ceramic Chip, 10uF, 35V, 20% (X7R), SMD 1206 [LCA114]; Value: 10u; FMEDA__OPERATING__TEMP_MAX: 50; FMEDA__OPERATING__TEMP_TYP: 27; FMEDA__OPERATING__TEMP_MIN: -20; FMEDA__OPERATING__VOLTAGE_MAX: 3.3; FMEDA__OPERATING__VOLTAGE_MIN: 0; FMEDA__CHANNEL: COM; FMEDA__FUNCTION_IN_SYSTEM: *; FMEDA__OPERATING__VOLTAGE_TYP: 3.3
IC4-IC9 = EL-17-21VGC/TR8: LED, SMD, 0805 Green [LIC016]; FMEDA__OPERATING__TEMP_MAX: 50; FMEDA__OPERATING__TEMP_MIN: -20; FMEDA__OPERATING__TEMP_TYP: 27; FMEDA__CHANNEL: COM; FMEDA__FUNCTION_IN_SYSTEM: *
Q1-Q6 = BSS138: FET, N Channel, Logic Level, SMD SOT23 [LIC163]; FMEDA__OPERATING__TEMP_MAX: 50; FMEDA__OPERATING__TEMP_MIN: -20; FMEDA__OPERATING__TEMP_TYP: 27; FMEDA__CHANNEL: COM
R10 R15 R18 R22 R25 R29 R32 R36 R39 R43 R46 R50 R53 = 1K0 / 0.063W / 1% / SMD 0603: Resistor, Ceramic Chip, 1K0, 0.063W, 1%, SMD 0603 [LRE106]; Value: 1K; FMEDA__OPERATING__POWER_MAX: 0; FMEDA__OPERATING__TEMP_MAX: 50; FMEDA__OPERATING__TEMP_MIN: -20; FMEDA__OPERATING__TEMP_TYP: 27; FMEDA__CHANNEL: COM; FMEDA__OPERATING__POWER_MIN: 0; FMEDA__OPERATING__VOLTAGE_MAX: 0; FMEDA__OPERATING__VOLTAGE_MIN: 0; FMEDA__OPERATING__VOLTAGE_TYP: 0; FMEDA__FUNCTION_IN_SYSTEM: *
R11 R19 R26 R33 R40 R47 = 100K / 0.063W / 1% / SMD 0603: Resistor, Ceramic Chip, 100K0, 0.063W, 1%, SMD 0603 [LRE107]; FMEDA__OPERATING__POWER_MAX: 0; FMEDA__OPERATING__TEMP_MAX: 50; FMEDA__OPERATING__TEMP_MIN: -20; FMEDA__OPERATING__TEMP_TYP: 27; FMEDA__CHANNEL: COM; Value: 100K; FMEDA__OPERATING__POWER_MIN: 0; FMEDA__OPERATING__VOLTAGE_MAX: 0; FMEDA__OPERATING__VOLTAGE_MIN: 0; FMEDA__OPERATING__VOLTAGE_TYP: 0; FMEDA__FUNCTION_IN_SYSTEM: *
R12 R54 = 10R / 0.125W / 1% / SMD 0603: Resistor, Ceramic Chip, 10R, 0.063W, 1%, SMD 0603 [LRE126]; Value: 10; FMEDA__OPERATING__POWER_MAX: 0; FMEDA__OPERATING__TEMP_MAX: 50; FMEDA__OPERATING__TEMP_MIN: -20; FMEDA__OPERATING__TEMP_TYP: 27; FMEDA__CHANNEL: COM; FMEDA__FUNCTION_IN_SYSTEM: *; FMEDA__OPERATING__POWER_MIN: 0; FMEDA__OPERATING__VOLTAGE_MAX: 0; FMEDA__OPERATING__VOLTAGE_MIN: 0; FMEDA__OPERATING__VOLTAGE_TYP: 0
R13 R14 R16 R17 R20 R21 R23 R24 R27 R28 R30 R31 R34 R35 R37 R38 R41 R42 R44 R45 R48 R49 R51 R52 = 82.5R / 0.25W / 1% / SMD 1206: Resistor, Ceramic Chip, 82.5R, 0.25W, 1%, SMD 1206 [LRE202]; VALUE: 82.5; FMEDA__OPERATING__POWER_MAX: 0; FMEDA__OPERATING__TEMP_MAX: 50; FMEDA__OPERATING__TEMP_MIN: -20; FMEDA__OPERATING__TEMP_TYP: 27; FMEDA__CHANNEL: COM; FMEDA__OPERATING__POWER_MIN: 0; FMEDA__OPERATING__VOLTAGE_MAX: 0; FMEDA__OPERATING__VOLTAGE_MIN: 0; FMEDA__OPERATING__VOLTAGE_TYP: 0; FMEDA__FUNCTION_IN_SYSTEM: *

## Sheet LPCB225 - STACK CONNECTORS.SchDoc
size A3; Address1: Factory 10; Address2: 9-13 Dingley Avenue, Dandeong, VICTORIA 3175, AUSTRALIA; DocumentNumber: 6; Revision: 1; SheetNumber: 6; SheetTotal: 6; Lockie__PCB_SUB_ASSEMBLY: Stackup Connectors; Lockie__PCB_ASSEMBLY: Module; Lockie__LDL: LPCB225; Lockie__PCB_DESCRIPTION: BMS Module
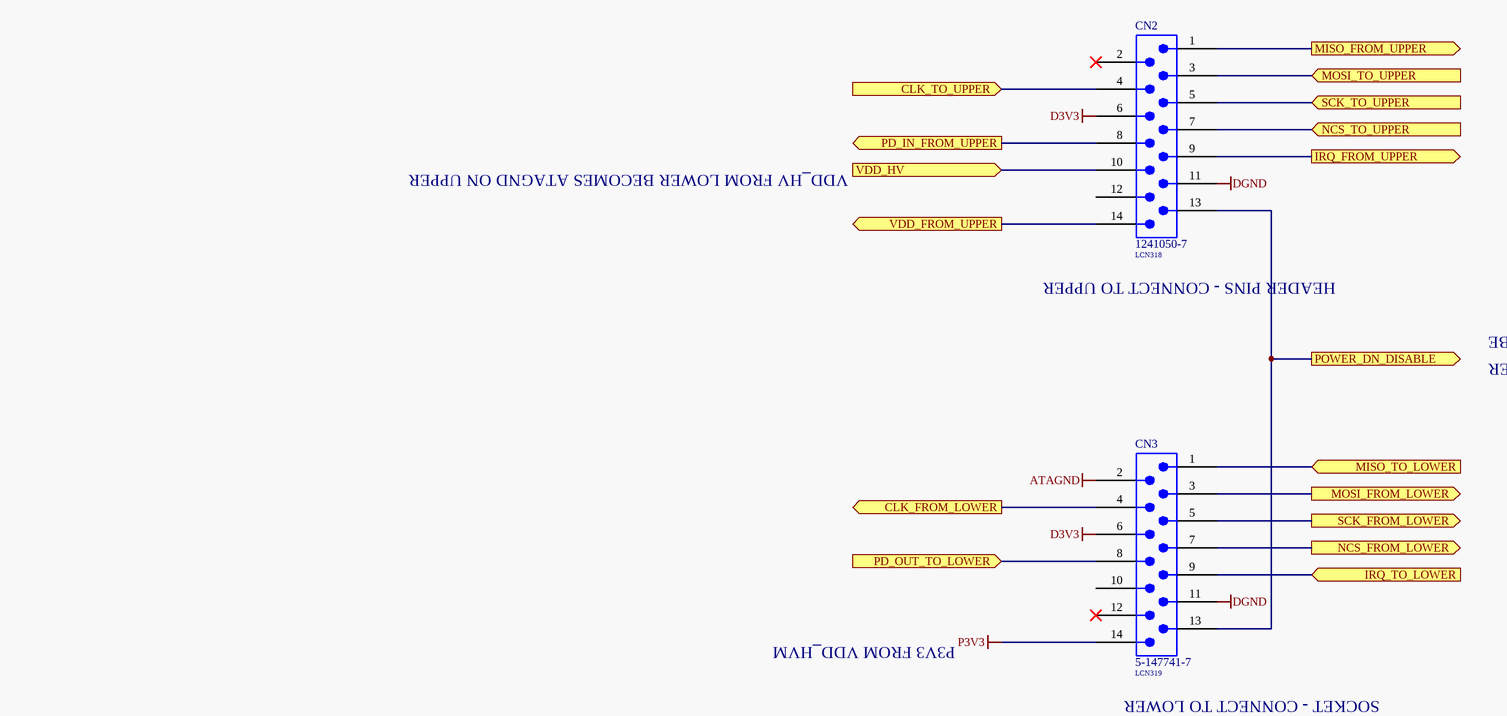
[diagram p3: LPCB225 - STACK CONNECTORS.SchDoc]

### Parts
CN2  1241050-7  LDL_NUMBER: LCN318  [1241050-7]
CN3  5-147741-7  LDL_NUMBER: LCN319  [5-147741-7]

### Ports
CLK_FROM_LOWER (out), CLK_TO_UPPER (in), IRQ_FROM_UPPER (out), IRQ_TO_LOWER (in), MISO_FROM_UPPER (out), MISO_TO_LOWER (in), MOSI_FROM_LOWER (out), MOSI_TO_UPPER (in), NCS_FROM_LOWER (out), NCS_TO_UPPER (in), PD_IN_FROM_UPPER (out), PD_OUT_TO_LOWER (in), POWER_DN_DISABLE (out), SCK_FROM_LOWER (out), SCK_TO_UPPER (in), VDD_FROM_UPPER (out), VDD_HV (in)

### Nets
ATAGND: CN3.2
D3V3: CN2.6 CN3.6
DGND: CN2.11 CN3.11
P3V3: CN3.14
CLK_FROM_LOWER: CN3.4 ; port CLK_FROM_LOWER
CLK_TO_UPPER: CN2.4 ; port CLK_TO_UPPER
IRQ_FROM_UPPER: CN2.9 ; port IRQ_FROM_UPPER
IRQ_TO_LOWER: CN3.9 ; port IRQ_TO_LOWER
MISO_FROM_UPPER: CN2.1 ; port MISO_FROM_UPPER
MISO_TO_LOWER: CN3.1 ; port MISO_TO_LOWER
MOSI_FROM_LOWER: CN3.3 ; port MOSI_FROM_LOWER
MOSI_TO_UPPER: CN2.3 ; port MOSI_TO_UPPER
NCS_FROM_LOWER: CN3.7 ; port NCS_FROM_LOWER
NCS_TO_UPPER: CN2.7 ; port NCS_TO_UPPER
PD_IN_FROM_UPPER: CN2.8 ; port PD_IN_FROM_UPPER
PD_OUT_TO_LOWER: CN3.8 ; port PD_OUT_TO_LOWER
SCK_FROM_LOWER: CN3.5 ; port SCK_FROM_LOWER
SCK_TO_UPPER: CN2.5 ; port SCK_TO_UPPER
VDD_FROM_UPPER: CN2.14 ; port VDD_FROM_UPPER
VDD_HV: CN2.10 ; port VDD_HV
NetCN2_13: CN2.13 CN3.13 ; port POWER_DN_DISABLE

Not connected (* = marked no-connect by the designer): CN2 2* 12; CN3 10 12*

### Notes on the sheet
- VDD_HV FROM LOWER BECOMES ATAGND ON UPPER
- HEADER PINS - CONNECT TO UPPER
- ALLOWS PWR_DN ON TOP BOARD TO BE
- CONTROLLER BY BASE MASTER
- P3V3 FROM VDD_HVM
- SOCKET - CONNECT TO LOWER
- PCB COMPONENT DESCRIPTION
- LDL NUMBER
- Assembly Details
- Size
- Drawing File Name
- Revision
- http://rloop.org
- Scale
- A3
- Sheet Details
- N.T.S
- Sheet:
- Of:

### Library data of the parts
CN2 = 1241050-7: Connector, Header, 2.54mm, 7 Pins x 2 Rows, SMD; FMEDA__CHANNEL: COM; FMEDA__OPERATING__CURRENT_MAX: 0; FMEDA__OPERATING__TEMP_MAX: 50; FMEDA__OPERATING__TEMP_MIN: -20; FMEDA__OPERATING__TEMP_TYP: 27; FMEDA__OPERATING__VOLTAGE_MAX: 16; FMEDA__OPERATING__VOLTAGE_TYP: 12; FMEDA__FUNCTION_IN_SYSTEM: *; FMEDA__OPERATING__CURRENT_MIN: 0; FMEDA__OPERATING__CURRENT_TYP: 0; FMEDA__OPERATING__VOLTAGE_MIN: 0
CN3 = 5-147741-7: Connector, Socket, 2.54mm, 7 pins x 2 Rows, SMD; FMEDA__CHANNEL: COM; FMEDA__OPERATING__CURRENT_MAX: 0; FMEDA__OPERATING__TEMP_MAX: 50; FMEDA__OPERATING__TEMP_MIN: -20; FMEDA__OPERATING__TEMP_TYP: 27; FMEDA__OPERATING__VOLTAGE_MAX: 16; FMEDA__OPERATING__VOLTAGE_TYP: 12; FMEDA__FUNCTION_IN_SYSTEM: *; FMEDA__OPERATING__CURRENT_MIN: 0; FMEDA__OPERATING__CURRENT_TYP: 0; FMEDA__OPERATING__VOLTAGE_MIN: 0

## Sheet LPCB225 - CLOCK.SchDoc
size A3; Address1: Factory 10; Address2: 9-13 Dingley Avenue, Dandeong, VICTORIA 3175, AUSTRALIA; DocumentNumber: 2; Revision: 1; SheetNumber: 2; SheetTotal: 6; Lockie__PCB_SUB_ASSEMBLY: Clock Generator; Lockie__PCB_ASSEMBLY: Module; Lockie__LDL: LPCB225; Lockie__PCB_DESCRIPTION: BMS Module
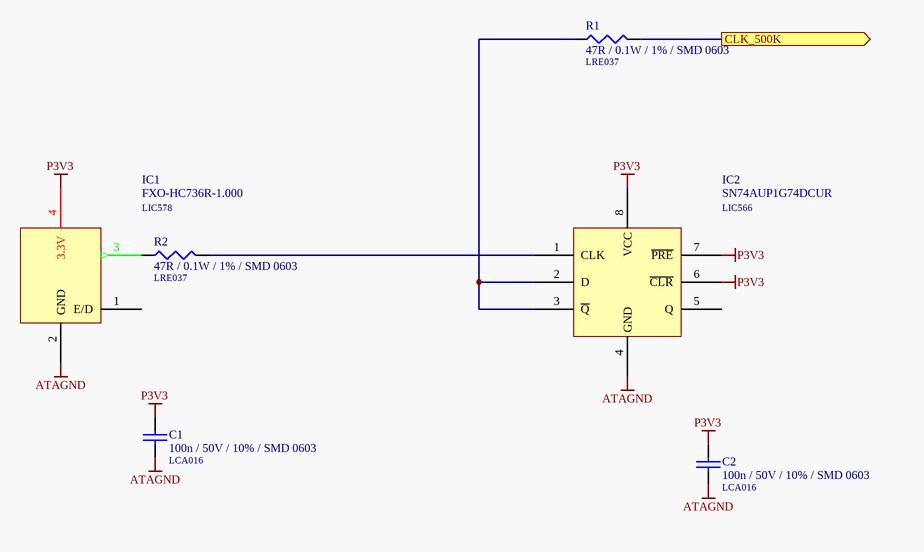
[diagram p4: LPCB225 - CLOCK.SchDoc]

### Parts
C1  100n / 50V / 10% / SMD 0603  LDL_NUMBER: LCA016  [LFP011__CC1608-0603-IPC7351_B]
C2  100n / 50V / 10% / SMD 0603  LDL_NUMBER: LCA016  [LFP011__CC1608-0603-IPC7351_B]
IC1  FXO-HC736R-1.000  LDL_NUMBER: LIC578  [LFP132__SMO-190]
IC2  SN74AUP1G74DCUR  LDL_NUMBER: LIC566  [LFP052__DCU-S-PDSO-G8]
R1  47R / 0.1W / 1% / SMD 0603  LDL_NUMBER: LRE037  [LFP020__CR1608-0603-IPC7351_B]
R2  47R / 0.1W / 1% / SMD 0603  LDL_NUMBER: LRE037  [LFP020__CR1608-0603-IPC7351_B]

### Ports
CLK_500K (out)

### Nets
ATAGND: C1.2 C2.2 IC1.2(GND) IC2.4(GND)
P3V3: C1.1 C2.1 IC1.4(3.3V) IC2.6(~{CLR}) IC2.7(~{PRE}) IC2.8(VCC)
CLK_FROM_LOWER: R1.2 ; port CLK_500K
NetIC1_3: IC1.3(OUT) R2.1
NetIC2_1: IC2.1(CLK) R2.2
NetIC2_2: IC2.2(D) IC2.3(~{Q}) R1.1

Not connected (* = marked no-connect by the designer): IC1 1(E/D); IC2 5(Q)

### Notes on the sheet
- PCB COMPONENT DESCRIPTION
- LDL NUMBER
- Assembly Details
- Size
- Drawing File Name
- Revision
- http://rloop.org
- Scale
- A3
- Sheet Details
- N.T.S
- Sheet:
- Of:

### Library data of the parts
C1 C2 = 100n / 50V / 10% / SMD 0603: as C3 on sheet LPCB225 - CONTROLLER; Value: 100n; FMEDA__FUNCTION_IN_SYSTEM: *; FMEDA__OPERATING__VOLTAGE_TYP: 3.3
IC1 = FXO-HC736R-1.000: IC, Oscillator Module, 1MHz, 3.3V, SMD [LIC578]; FMEDA__OPERATING__TEMP_MAX: 50; FMEDA__OPERATING__TEMP_MIN: -20; FMEDA__OPERATING__TEMP_TYP: 27; FMEDA__OPERATING__VOLTAGE_MAX: 3.3; FMEDA__OPERATING__VOLTAGE_MIN: 0; FMEDA__CHANNEL: COM; FMEDA__OPERATING__VOLTAGE_TYP: 3.3; FMEDA__FUNCTION_IN_SYSTEM: *
IC2 = SN74AUP1G74DCUR: IC, Flip Flop, SMD SOP8 [LIC566]; FMEDA__OPERATING__TEMP_MAX: 85; FMEDA__OPERATING__TEMP_MIN: -40; FMEDA__OPERATING__TEMP_TYP: 27; FMEDA__OPERATING__VOLTAGE_MAX: 3.6; FMEDA__OPERATING__VOLTAGE_MIN: 0.8; FMEDA__OPERATING__VOLTAGE_TYP: 0; FMEDA__CHANNEL: COM; FMEDA__FUNCTION_IN_SYSTEM: *
R1 R2 = 47R / 0.1W / 1% / SMD 0603: Resistor, Ceramic Chip, 47R, 0.1W, 1%, SMD 0603 [LRE037]; VALUE: 47; FMEDA__OPERATING__POWER_MAX: 0; FMEDA__OPERATING__TEMP_MAX: 50; FMEDA__OPERATING__TEMP_MIN: -20; FMEDA__OPERATING__TEMP_TYP: 27; FMEDA__CHANNEL: COM; FMEDA__OPERATING__POWER_MIN: 0; FMEDA__OPERATING__VOLTAGE_MAX: 0; FMEDA__OPERATING__VOLTAGE_MIN: 0; FMEDA__OPERATING__VOLTAGE_TYP: 0; FMEDA__FUNCTION_IN_SYSTEM: *

## Sheet LPCB225 - POWER DOWN CONTROLLER.SchDoc
size A3; Address1: Factory 10; Address2: 9-13 Dingley Avenue, Dandeong, VICTORIA 3175, AUSTRALIA; DocumentNumber: 5; Revision: 1; SheetNumber: 5; SheetTotal: 6; Lockie__PCB_SUB_ASSEMBLY: Power Down Controller; Lockie__PCB_ASSEMBLY: Module; Lockie__LDL: LPCB225; Lockie__PCB_DESCRIPTION: BMS Module
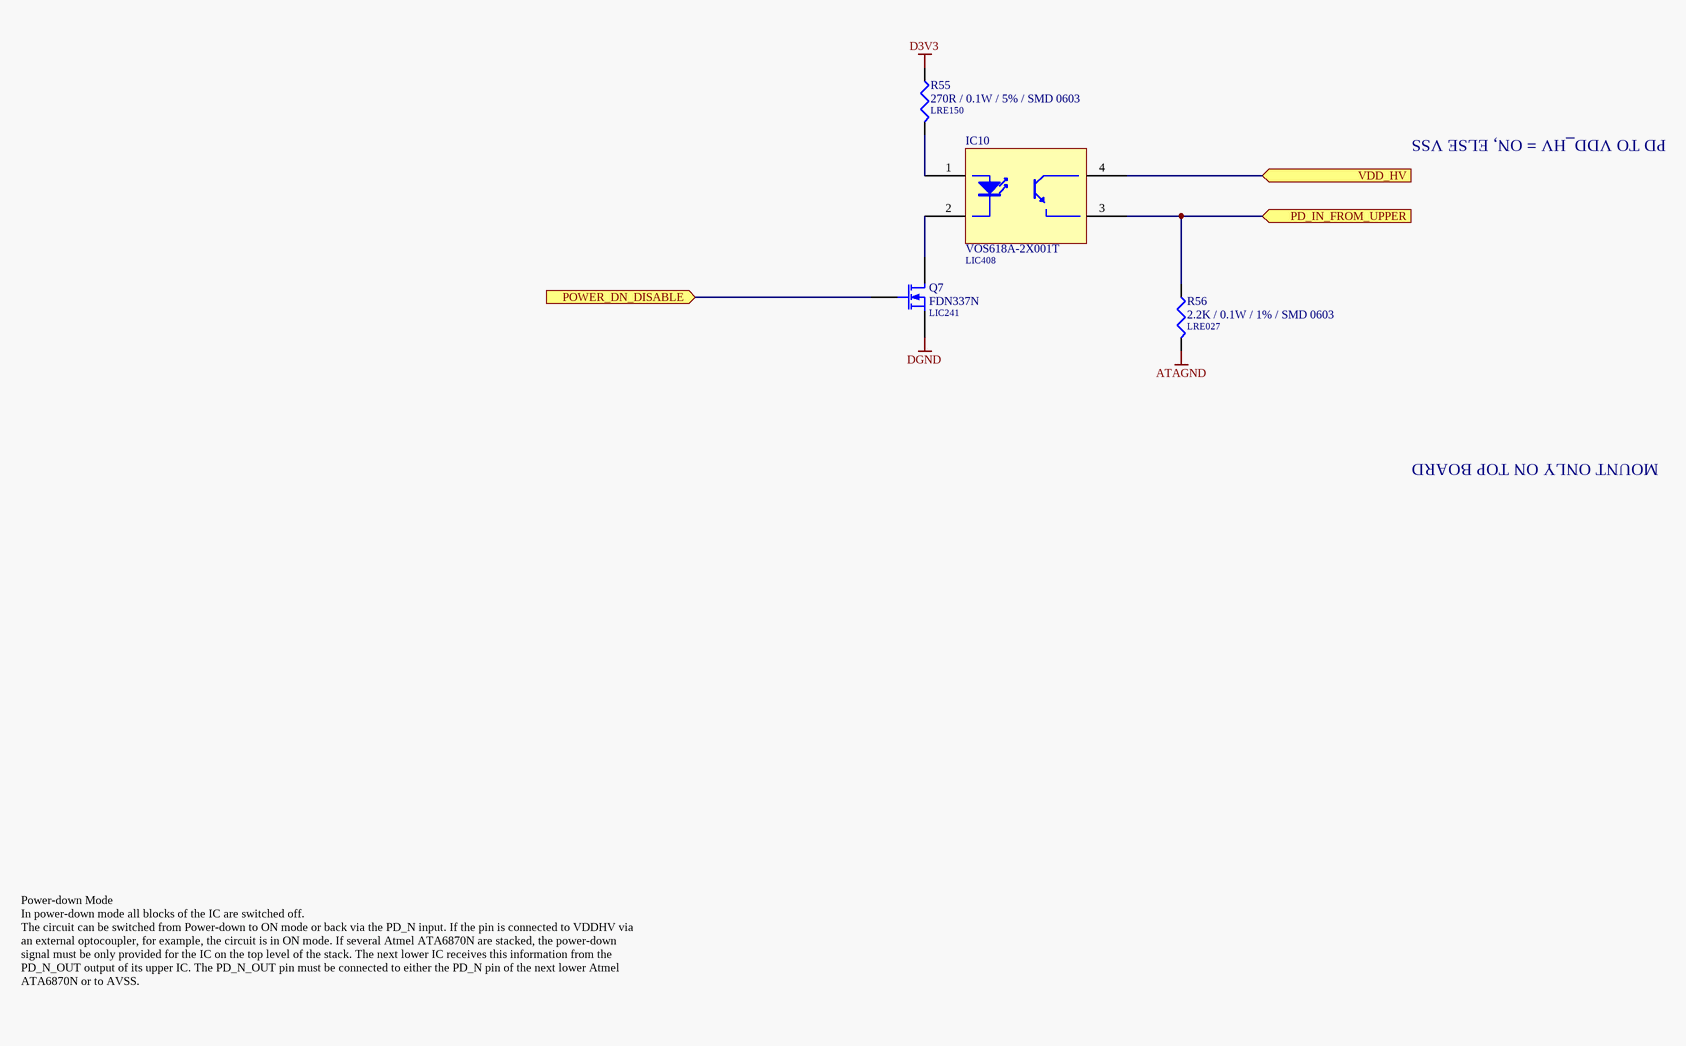
[diagram p5: LPCB225 - POWER DOWN CONTROLLER.SchDoc]

### Parts
IC10  VOS618A-2X001T  LDL_NUMBER: LIC408  [LFP085__VOS618A]
Q7  FDN337N  LDL_NUMBER: LIC241  [LFP021__SOT23]
R55  270R / 0.1W / 5% / SMD 0603  LDL_NUMBER: LRE150  [LFP020__CR1608-0603-IPC7351_B]
R56  2.2K / 0.1W / 1% / SMD 0603  LDL_NUMBER: LRE027  [LFP020__CR1608-0603-IPC7351_B]

### Ports
PD_IN_FROM_UPPER (in), POWER_DN_DISABLE (in), VDD_HV (in)

### Nets
ATAGND: R56.1
D3V3: R55.2
DGND: Q7.2(S)
PD_IN_FROM_UPPER: IC10.3 R56.2 ; port PD_IN_FROM_UPPER
VDD_HV: IC10.4 ; port VDD_HV
NetCN2_13: Q7.1(G) ; port POWER_DN_DISABLE
NetIC10_1: IC10.1(A) R55.1
NetIC10_2: IC10.2(K) Q7.3(D)

### Notes on the sheet
- PD TO VDD_HV = ON, ELSE VSS
- MOUNT ONLY ON TOP BOARD
- Power-down Mode
  In power-down mode all blocks of the IC are switched off.
  The circuit can be switched from Power-down to ON mode or back via the PD_N input. If the pin is connected to VDDHV via
  an external optocoupler, for example, the circuit is in ON mode. If several Atmel ATA6870N are stacked, the power-down
  signal must be only provided for the IC on the top level of the stack. The next lower IC receives this information from the
  PD_N_OUT output of its upper IC. The PD_N_OUT pin must be connected to either the PD_N pin of the next lower Atmel
  ATA6870N or to AVSS.
- PCB COMPONENT DESCRIPTION
- LDL NUMBER
- Assembly Details
- Size
- Drawing File Name
- Revision
- http://rloop.org
- Scale
- A3
- Sheet Details
- N.T.S
- Sheet:
- Of:

### Library data of the parts
IC10 = VOS618A-2X001T: IC, Optocoupler, SMD [LIC408]; FMEDA__OPERATING__TEMP_MAX: 50; FMEDA__OPERATING__TEMP_MIN: -20; FMEDA__OPERATING__TEMP_TYP: 27; FMEDA__CHANNEL: COM
Q7 = FDN337N: FET, N Channel, Logic Level, SMD SOT23 [LIC241]; FMEDA__OPERATING__POWER_MAX: 0; FMEDA__OPERATING__TEMP_MAX: 50; FMEDA__OPERATING__TEMP_TYP: 27; FMEDA__OPERATING__VOLTAGE_MAX: 3.3; FMEDA__OPERATING__TEMP_MIN: -20; FMEDA__CHANNEL: COM; FMEDA__OPERATING__POWER_MIN: 0; FMEDA__OPERATING__POWER_TYP: 0; FMEDA__OPERATING__VOLTAGE_MIN: 0; FMEDA__OPERATING__VOLTAGE_TYP: 3.3; FMEDA__FUNCTION_IN_SYSTEM: *
R55 = 270R / 0.1W / 5% / SMD 0603: Resistor, Ceramic Chip, 270R, 0.1W, 1%, SMD 0603 [LRE150]; Value: 820; FMEDA__OPERATING__POWER_MAX: 0; FMEDA__OPERATING__TEMP_MAX: 50; FMEDA__OPERATING__TEMP_MIN: -20; FMEDA__OPERATING__TEMP_TYP: 27; FMEDA__CHANNEL: COM; FMEDA__OPERATING__POWER_MIN: 0; FMEDA__OPERATING__VOLTAGE_MAX: 0; FMEDA__OPERATING__VOLTAGE_MIN: 0; FMEDA__OPERATING__VOLTAGE_TYP: 0; FMEDA__FUNCTION_IN_SYSTEM: *
R56 = 2.2K / 0.1W / 1% / SMD 0603: Resistor, Ceramic Chip, 2.2K, 0.1W, 1%, SMD 0603 [LRE027]; FMEDA__OPERATING__VOLTAGE_MIN: 0; FMEDA__OPERATING__TEMP_MIN: -20; FMEDA__OPERATING__TEMP_TYP: 27; FMEDA__OPERATING__TEMP_MAX: 50; FMEDA__CHANNEL: COM; VALUE: 2.2K; FMEDA__OPERATING__VOLTAGE_MAX: 0; FMEDA__OPERATING__POWER_MIN: 0; FMEDA__OPERATING__POWER_MAX: 0; FMEDA__FUNCTION_IN_SYSTEM: *; FMEDA__OPERATING__VOLTAGE_TYP: 0

## Nets that join several sheets
ATAGND: LPCB225 - CONTROLLER (15 pins), LPCB225 - DISCHARGE (C13.2 R54.1), LPCB225 - STACK CONNECTORS (CN3.2), LPCB225 - CLOCK (C1.2 C2.2 IC1.2 IC2.4), LPCB225 - POWER DOWN CONTROLLER (R56.1)
D3V3: LPCB225 - STACK CONNECTORS (CN2.6 CN3.6), LPCB225 - POWER DOWN CONTROLLER (R55.2)
DGND: LPCB225 - STACK CONNECTORS (CN2.11 CN3.11), LPCB225 - POWER DOWN CONTROLLER (Q7.2)
P3V3: LPCB225 - CONTROLLER (C11.1 C12.1 IC3.36 R4.2), LPCB225 - STACK CONNECTORS (CN3.14), LPCB225 - CLOCK (6 pins)
CELL_1: LPCB225 - OVERVIEW (CN1.7), LPCB225 - DISCHARGE (Q6.2 R53.1 R54.2)
CELL_2: LPCB225 - OVERVIEW (CN1.6), LPCB225 - DISCHARGE (7 pins)
CELL_3: LPCB225 - OVERVIEW (CN1.5), LPCB225 - DISCHARGE (7 pins)
CELL_4: LPCB225 - OVERVIEW (CN1.4), LPCB225 - DISCHARGE (7 pins)
CELL_5: LPCB225 - OVERVIEW (CN1.3), LPCB225 - DISCHARGE (7 pins)
CELL_6: LPCB225 - OVERVIEW (CN1.2), LPCB225 - DISCHARGE (7 pins)
CELL_7: LPCB225 - OVERVIEW (CN1.1), LPCB225 - DISCHARGE (7 pins)
CLK_FROM_LOWER: LPCB225 - CONTROLLER (IC3.12), LPCB225 - STACK CONNECTORS (CN3.4), LPCB225 - CLOCK (R1.2)
CLK_TO_UPPER: LPCB225 - CONTROLLER (IC3.43), LPCB225 - STACK CONNECTORS (CN2.4)
IRQ_FROM_UPPER: LPCB225 - CONTROLLER (IC3.44), LPCB225 - STACK CONNECTORS (CN2.9)
IRQ_TO_LOWER: LPCB225 - CONTROLLER (IC3.11 R4.1), LPCB225 - STACK CONNECTORS (CN3.9)
MBAT1: LPCB225 - CONTROLLER (C5.2 IC3.10), LPCB225 - DISCHARGE (R53.2)
MBAT2: LPCB225 - CONTROLLER (C5.1 C6.2 IC3.8), LPCB225 - DISCHARGE (R46.2)
MBAT3: LPCB225 - CONTROLLER (C6.1 C7.2 IC3.6), LPCB225 - DISCHARGE (R39.2)
MBAT4: LPCB225 - CONTROLLER (C7.1 C8.2 IC3.4), LPCB225 - DISCHARGE (R32.2)
MBAT5: LPCB225 - CONTROLLER (C8.1 C9.2 IC3.2), LPCB225 - DISCHARGE (R25.2)
MBAT6: LPCB225 - CONTROLLER (C9.1 C14.2 IC3.48), LPCB225 - DISCHARGE (R18.2)
MBAT7: LPCB225 - CONTROLLER (C14.1 IC3.46), LPCB225 - DISCHARGE (R10.2)
MISO_FROM_UPPER: LPCB225 - CONTROLLER (IC3.39), LPCB225 - STACK CONNECTORS (CN2.1)
MISO_TO_LOWER: LPCB225 - CONTROLLER (IC3.16), LPCB225 - STACK CONNECTORS (CN3.1)
MOSI_FROM_LOWER: LPCB225 - CONTROLLER (IC3.15), LPCB225 - STACK CONNECTORS (CN3.3)
MOSI_TO_UPPER: LPCB225 - CONTROLLER (IC3.40), LPCB225 - STACK CONNECTORS (CN2.3)
NCS_FROM_LOWER: LPCB225 - CONTROLLER (IC3.13), LPCB225 - STACK CONNECTORS (CN3.7)
NCS_TO_UPPER: LPCB225 - CONTROLLER (IC3.42), LPCB225 - STACK CONNECTORS (CN2.7)
NetCN2_13: LPCB225 - STACK CONNECTORS (CN2.13 CN3.13), LPCB225 - POWER DOWN CONTROLLER (Q7.1)
NetIC3_1: LPCB225 - CONTROLLER (IC3.1), LPCB225 - DISCHARGE (R22.2)
NetIC3_3: LPCB225 - CONTROLLER (IC3.3), LPCB225 - DISCHARGE (R29.2)
NetIC3_5: LPCB225 - CONTROLLER (IC3.5), LPCB225 - DISCHARGE (R36.2)
NetIC3_7: LPCB225 - CONTROLLER (IC3.7), LPCB225 - DISCHARGE (R43.2)
NetIC3_9: LPCB225 - CONTROLLER (IC3.9), LPCB225 - DISCHARGE (R50.2)
NetIC3_47: LPCB225 - CONTROLLER (IC3.47), LPCB225 - DISCHARGE (R15.2)
PD_IN_FROM_UPPER: LPCB225 - CONTROLLER (IC3.38), LPCB225 - STACK CONNECTORS (CN2.8), LPCB225 - POWER DOWN CONTROLLER (IC10.3 R56.2)
PD_OUT_TO_LOWER: LPCB225 - CONTROLLER (IC3.35), LPCB225 - STACK CONNECTORS (CN3.8)
SCK_FROM_LOWER: LPCB225 - CONTROLLER (IC3.14), LPCB225 - STACK CONNECTORS (CN3.5)
SCK_TO_UPPER: LPCB225 - CONTROLLER (IC3.41), LPCB225 - STACK CONNECTORS (CN2.5)
VDD_FROM_UPPER: LPCB225 - CONTROLLER (IC3.37 R3.2), LPCB225 - STACK CONNECTORS (CN2.14)
VDD_HV: LPCB225 - CONTROLLER (IC3.45 R3.1), LPCB225 - DISCHARGE (C13.1 R12.1), LPCB225 - STACK CONNECTORS (CN2.10), LPCB225 - POWER DOWN CONTROLLER (IC10.4)